# EAGLE design 400D Audio-LED (EAGLE 9.5.0)
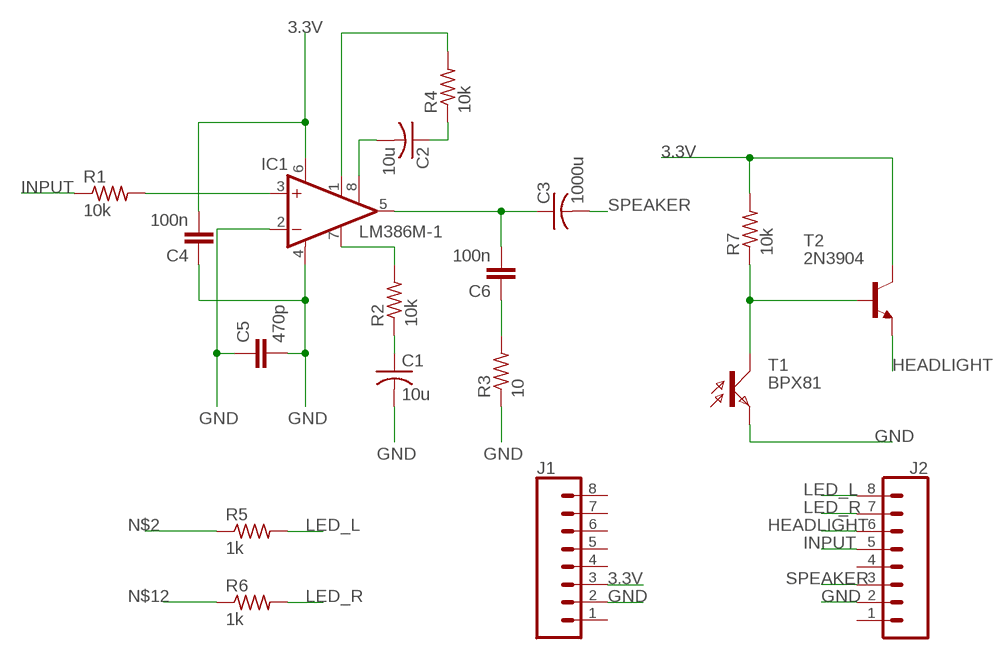
[diagram p0: schematic, sheet 1]

## Parts
C1  10u  C-USC0805  [C0805]
C2  10u  C-USC0805  [C0805]
C3  1000u  C-USC0805  [C0805]
C4  100n  C-EUC0805  [C0805]
C5  470p  C-EUC0805  [C0805]
C6  100n  C-EUC0805  [C0805]
IC1  LM386M-1  [SO08]
J1  CONN_08"  [1X08]
J2  CONN_08"  [1X08]
R1  10k  R-US_R0805  [R0805]
R2  10k  R-US_R0805  [R0805]
R3  10  R-US_R0805  [R0805]
R4  10k  R-US_R0805  [R0805]
R5  1k  R-US_R0805  [R0805]
R6  1k  R-US_R0805  [R0805]
R7  10k  R-US_R0805  [R0805]
T1  BPX81  [BPX81]
T2  2N3904  [TO92]

## Nets
3.3V: C4.2 IC1.6(VS) J1.3 R7.2 T2.1(C)
GND: C1.2 C4.1 C5.1 C5.2 IC1.2(-IN) IC1.4(GND) J1.2 J2.2 R3.1 T1.E
HEADLIGHT: J2.6 T2.3(E)
INPUT: J2.5 R1.1
LED_L: J2.8 R5.2
LED_R: J2.7 R6.2
N$1: IC1.3(+IN) R1.2
N$2: R5.1
N$3: R7.1 T1.C T2.2(B)
N$5: IC1.7(BYPASS) R2.2
N$6: C1.1 R2.1
N$7: C3.1 C6.2 IC1.5(OUT)
N$8: C6.1 R3.2
N$9: C2.2 IC1.8(GAIN)
N$10: C2.1 R4.1
N$11: IC1.1(GAIN) R4.2
N$12: R6.1
SPEAKER: C3.2 J2.3
Unconnected: J1.1 J1.4 J1.5 J1.6 J1.7 J1.8 J2.1 J2.4

## Library data of the parts
C1-C3 = rcl:C-US: CAPACITOR, American symbol; SPICEPREFIX: C
C4-C6 = rcl:C-EU: CAPACITOR, European symbol; SPICEPREFIX: C
IC1 = linear:LM386?-*: Low Voltage Audio Power Amplifier Source: http://cache.national.com/ds/LM/LM386.pdf
J1 J2 = SparkFun-Connectors:CONN_08: Multi connection point. Often used as Generic Header-pin footprint for 0.1 inch spaced/style header connections On any of the 0.1 inch spaced packages, you can populate with these: Break Away Headers - Straight <https://www.sparkfun.com/products/116> (PRT-00116) Break Away Male Headers - Right Angle <https://www.sparkfun.com/products/553> (PRT-00553) Female Headers <https://www.sparkfun.com/products/115> (PRT-00115) Break Away Headers - Machine Pin <https://www.sparkfun.com/products/117> (PRT-00117) Break Away Female Headers - Swiss Machine Pin <https://www.sparkfun.com/products/743> (PRT-00743) Arduino Stackable Header - 8 Pin <https://www.sparkfun.com/products/9279> (PRT-09279) For SCREWTERMINALS and SPRING TERMINALS visit here: Screw Terimnals on SparkFun.com <https://www.sparkfun.com/search/results?term=Screw+Terminals> (5mm/3.5mm/2.54mm spacing) This device is also useful as a general connection point to wire up your design to another part of your project. Our various solder wires solder well into these plated through hole pads. Hook-Up Wire - Assortment (Stranded, 22 AWG) <https://www.sparkfun.com/products/11375> (PRT-11375) Hook-Up Wire - Assortment (Solid Core, 22 AWG) <https://www.sparkfun.com/products/11367> (PRT-11367) View the entire wire category on our website here <https://www.sparkfun.com/categories/141> Special notes: Molex polarized connector foot print use with SKU : PRT-08231 with associated crimp pins and housings. 1MM SMD Version SKU: PRT-10208 NOTES ON THE VARIANTS LOCK and LOCK_LONGPADS... This footprint was designed to help hold the alignment of a through-hole component (i.e. 6-pin header) while soldering it into place. You may notice that each hole has been shifted either up or down by 0.005 of an inch from it's more standard position (which is a perfectly straight line). This slight alteration caused the pins (the squares in the middle) to touch the edges of the holes. Because they are alternating, it causes a "brace" to hold the component in place. 0.005 has proven to be the perfect amount of "off-center" position when using our standard breakaway headers. Although looks a little odd when you look at the bare footprint, once you have a header in there, the alteration is very hard to notice. Also,if you push a header all the way into place, it is covered up entirely on the bottom side.; PROD_ID: CONN-08438
R1-R7 = rcl:R-US_: RESISTOR, American symbol; SPICEPREFIX: R
T1 = opto-trans-siemens:BPX81: PHOTO TRANSISTOR; OC_FARNELL: unknown; OC_NEWARK: unknown
T2 = transistor:2N3904: NPN TRANSISTOR

## Board
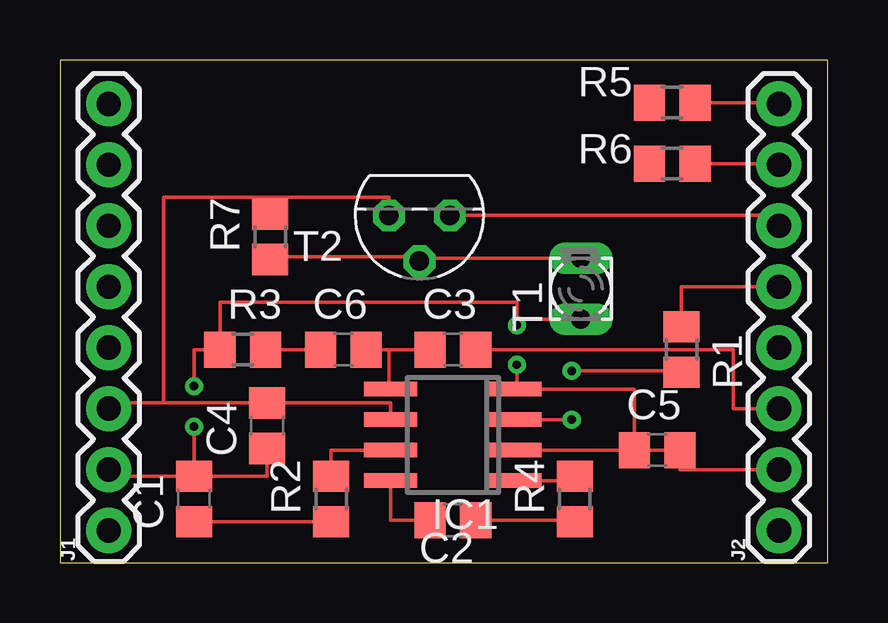
[diagram p1: board, top side]
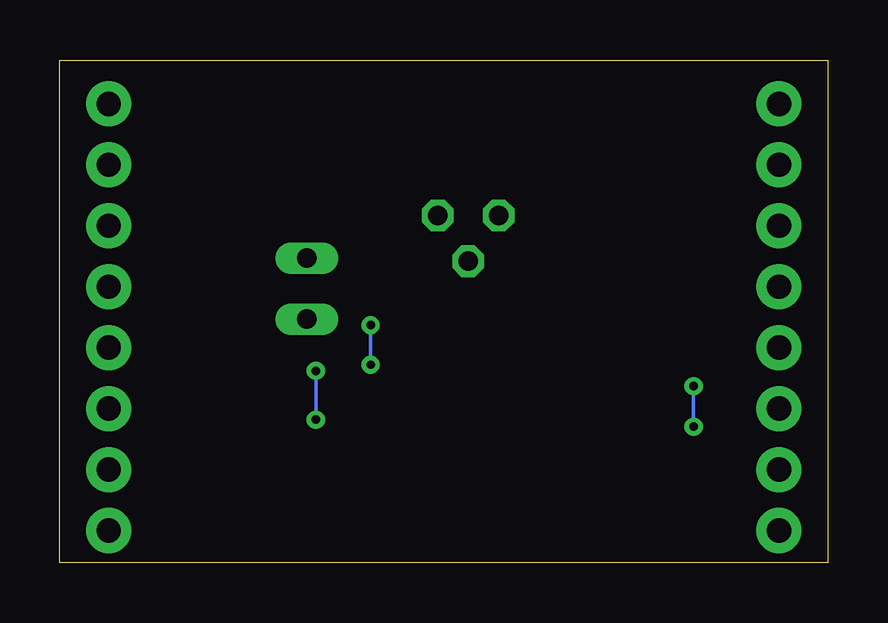
[diagram p2: board, bottom side, seen from below]

Size 32 x 20.95 mm. Coordinates in mm from the lower left corner, seen from the top.
Outline: 0,0 32,0 32,20.95 0,20.95 0,0
Copper layers (1*16): Top 0.035mm / dielectric 1.5mm / Bottom 0.035mm
Design rules "default": minimum track width 6mil, minimum drill 0.35mm, track to track 6mil, track to pad 6mil, pad to pad 6mil, via to via 6mil, smd to smd 6mil, copper to edge 40mil, drill to drill 6mil, minimum pad ring 10mil, minimum via ring 8mil, stop-mask expansion 4mil, vias tented up to drill 0mil, thermal gap 10mil

### Footprints (pad centres in the part's own frame; a part is rotated, then mirrored left to right if it is on the bottom)
C0805 = smd 1.3 x 1.5: 1 -0.95,0; 2 0.95,0
SO08 = smd 0.6 x 2.2: 1 -1.905,-2.6; 2 -0.635,-2.6; 3 0.635,-2.6; 4 1.905,-2.6; 5 1.905,2.6; 6 0.635,2.6; 7 -0.635,2.6; 8 -1.905,2.6
1X08 = drill 1.016 pad 1.88: 1 0,0; 2 2.54,0; 3 5.08,0; 4 7.62,0; 5 10.16,0; 6 12.7,0; 7 15.24,0; 8 17.78,0
R0805 = smd 1.3 x 1.5: 1 -0.95,0; 2 0.95,0
BPX81 = drill 0.813 long: C 1.27,0; E -1.27,0
TO92 = drill 0.813 octagon: 1 1.27,0; 2 0,1.905; 3 -1.27,0

### Placement (x,y rotation side)
C1  5.59,2.67 90 top
C2  16.38,1.78 180 top
C3  16.38,8.89 0 top
C4  8.64,5.71 90 top
C5  24.89,4.7 0 top
C6  11.81,8.89 0 top
IC1  16.38,5.33 90 top
J1  2.03,1.35 90 top
J2  29.97,1.35 90 top
R1  25.91,8.89 270 top
R2  11.3,2.67 90 top
R3  7.62,8.89 0 top
R4  21.46,2.67 90 top
R5  25.53,19.18 0 top
R6  25.53,16.64 0 top
R7  8.76,13.59 90 top
T1  21.72,11.43 90 top
T2  14.99,14.48 180 top

### Tracks (layer width: path | path; a pad name or v marks a point on that pad's centre or on a via)
3.3V
  Top 0.152: J1.3 2.03,6.67 4.32,6.67 | 4.32,6.67 C4.2 13.78,6.67 IC1.6 | 8.76,15.24 4.32,15.24 4.32,6.67 | 8.76,15.24 R7.2 | 8.76,15.24 13.72,15.24 T2.1
GND  (via drill 0.35)
  Top 0.152: J2.2 25.84,3.89 C5.2 C5.1 | C5.1 IC1.2 | IC1.4 19.05,7.24 | 19.05,7.24 23.94,7.24 C5.1 | C1.2 8.64,3.62 C4.1 | v5.59,7.37 5.59,8.89 R3.1 6.67,10.86 19.05,10.86 v19.05,9.91 19.05,10.16 T1.E | v5.59,5.68 C1.2 | J1.2 2.03,3.62 C1.2 | v19.05,8.26 19.05,7.24
  Bottom 0.152: v5.59,7.37 v5.59,5.68 | v19.05,9.91 v19.05,8.26
HEADLIGHT
  Top 0.152: T2.3 29.97,14.48 J2.6
INPUT
  Top 0.152: R1.1 25.91,11.51 J2.5
LED_L
  Top 0.152: R5.2 29.97,19.18 J2.8
LED_R
  Top 0.152: J2.7 29.92,16.64 R6.2
N$1  (via drill 0.35)
  Top 0.152: R1.2 25.91,8 v21.34,8 | v21.34,5.97 IC1.3
  Bottom 0.152: v21.34,8 v21.34,5.97
N$3
  Top 0.152: R7.1 8.89,12.77 14.99,12.77 T2.2 14.99,12.7 T1.C
N$5
  Top 0.152: R2.2 11.3,4.7 IC1.7
N$6
  Top 0.152: R2.1 C1.1
N$7
  Top 0.152: IC1.5 13.72,7.24 13.72,8.89 | C6.2 13.72,8.89 | 13.72,8.89 C3.1
N$8
  Top 0.152: C6.1 R3.2
N$9
  Top 0.152: C2.2 13.78,1.78 IC1.8
N$10
  Top 0.152: R4.1 21.4,1.78 C2.1
N$11
  Top 0.152: IC1.1 21.27,3.43 R4.2
SPEAKER
  Top 0.152: C3.2 28.07,8.89 28.07,6.43 J2.3